# EasyEDA schematic SCH_AcondicionadorSeñal.json
TITLE: Acondicionador de Señal; REV: 1.0; Date: 2025-07-11; Sheet: 1/1; Drawn By: Fernando Alexis Vale; Company: LABTEL Productions
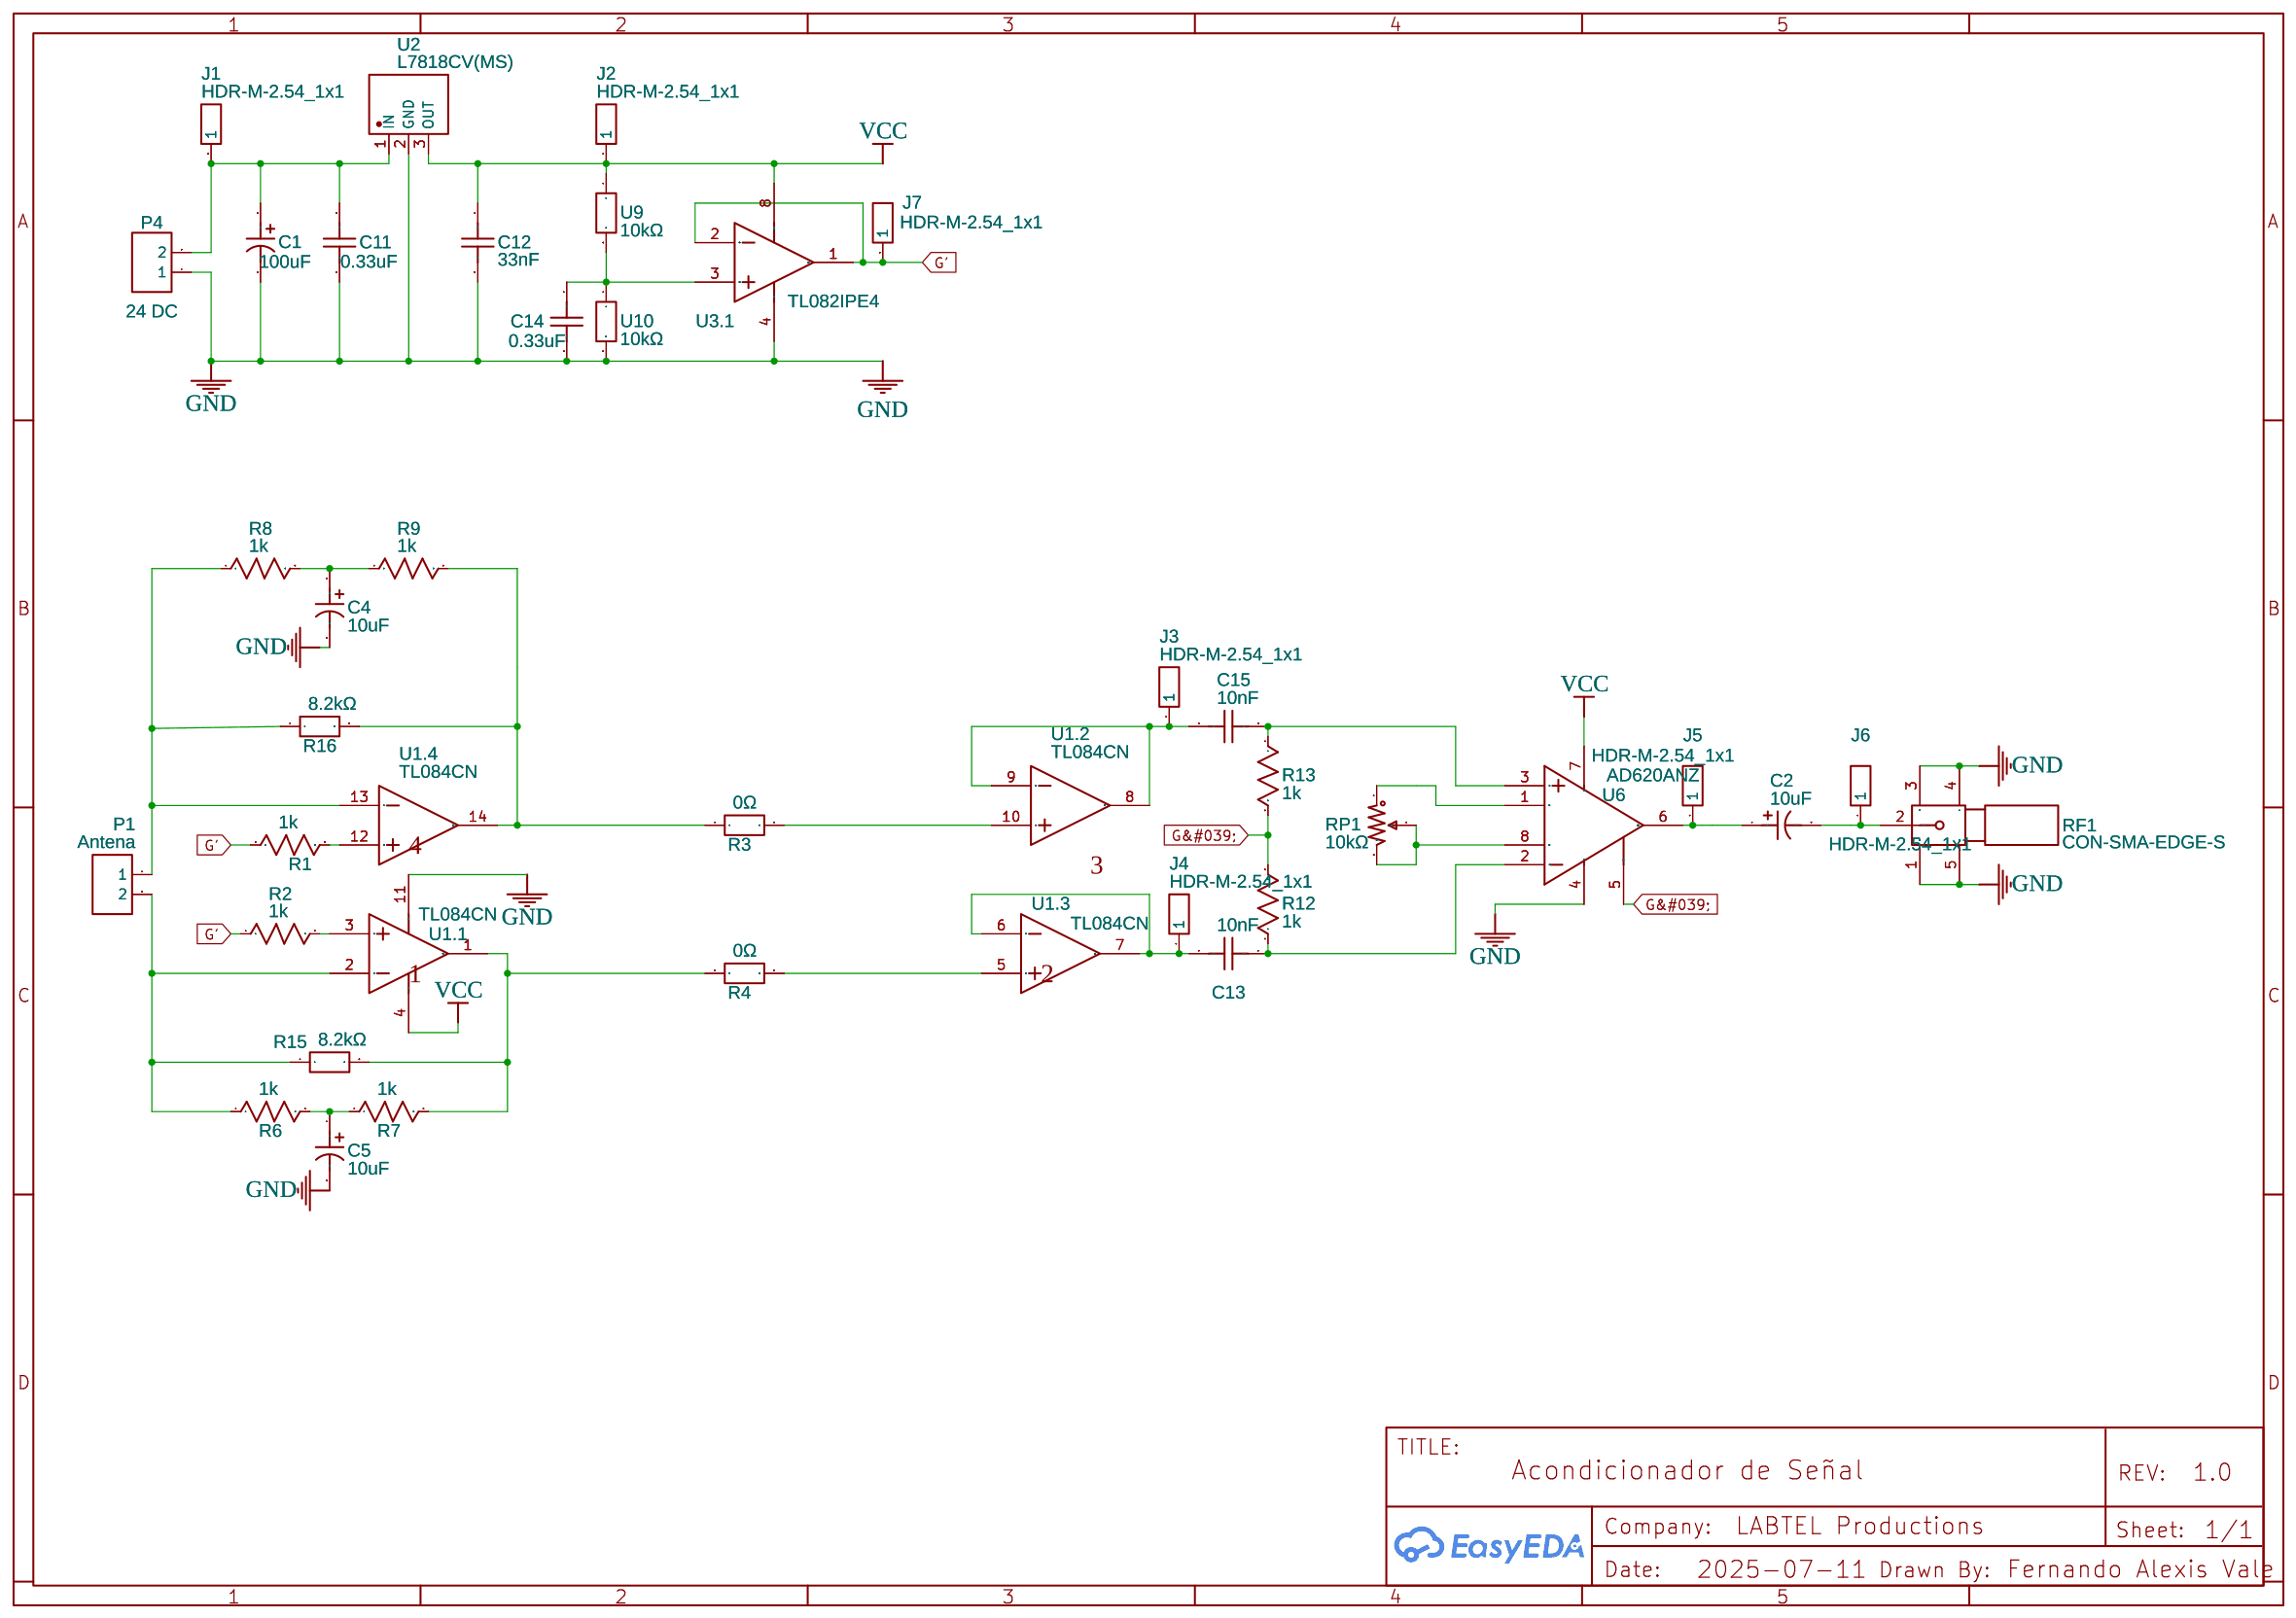
[diagram p0: schematic sheet]

## Parts
C1  100uF  [CAP-TH_BD6.3-P2.50-D0.5-FD]
C2  10uF  [CAP-TH_BD6.3-P2.50-D0.5-FD]
C4  10uF  [CAP-TH_BD6.3-P2.50-D0.5-FD]
C5  10uF  [CAP-TH_BD6.3-P2.50-D0.5-FD]
C11  0.33uF  [CAP-TH_L4.8-W3.2-P5.08-D0.5]
C12  33nF  [CAP-TH_L4.8-W3.2-P5.08-D0.5]
C13  10nF  [CAP-TH_L4.8-W3.2-P5.08-D1.2]
C14  0.33uF  [CAP-TH_L4.8-W3.2-P5.08-D0.5]
C15  10nF  [CAP-TH_L4.8-W3.2-P5.08-D1.2]
J1  HDR-M-2.54_1x1  [HDR-M-2.54_1X1]
J2  HDR-M-2.54_1x1  [HDR-M-2.54_1X1]
J3  HDR-M-2.54_1x1  [HDR-M-2.54_1X1]
J4  HDR-M-2.54_1x1  [HDR-M-2.54_1X1]
J5  HDR-M-2.54_1x1  [HDR-M-2.54_1X1]
J6  HDR-M-2.54_1x1  [HDR-M-2.54_1X1]
J7  HDR-M-2.54_1x1  [HDR-M-2.54_1X1]
P1  Antena  [CONN-TH_2P-P5.00]
P4  24 DC  [CONN-TH_2P-P5.00]
R1  1k  [R_AXIAL-0.4]
R2  1k  [R_AXIAL-0.4]
R3  0Ω  [RES-TH_BD2.7-L6.2-P10.20-D0.4]
R4  0Ω  [RES-TH_BD2.7-L6.2-P10.20-D0.4]
R6  1k  [R_AXIAL-0.4]
R7  1k  [R_AXIAL-0.4]
R8  1k  [R_AXIAL-0.4]
R9  1k  [R_AXIAL-0.4]
R12  1k  [R_AXIAL-0.4]
R13  1k  [R_AXIAL-0.4]
R15  8.2kΩ  [RES-TH_BD2.7-L6.2-P10.20-D0.4]
R16  8.2kΩ  [RES-TH_BD2.7-L6.2-P10.20-D0.4]
RF1  CON-SMA-EDGE-S  [SMA-SMD_CON-SMA-EDGE-S]
RP1  10kΩ  [TRIMPOT 9.53MM X 4.83MM]
U1  TL084CN  [DIP-14_L20.0-W7.6-P2.54-LS7.6-BL]  (sections 1,2,3,4)
U2  L7818CV(MS)  [TO-220-3_L9.9-W4.5-P2.54-L-1]
U3  TL082IPE4  [PDIP-8_L9.6-W6.4-P2.54-LS7.9-BL-1]  (section 1)
U6  AD620ANZ  [DIP-8_L9.3-W6.4-P2.54-LS7.6-BL]
U9  10kΩ  [RES-TH_BD2.3-L6.3-P10.30-D0.6]
U10  10kΩ  [RES-TH_BD2.3-L6.3-P10.30-D0.6]

## Library data of the parts
C1 C4 C5 = UPJ2A100MED: Supplier: LCSC; Supplier Part: C1582244; Manufacturer: Nichicon(尼吉康); JLCPCB Part Class: Extended Part; Contributor: lcsc
C2 = NPXC0421E100MJTM: Supplier: LCSC; Supplier Part: C2976241; Manufacturer: Ymin(永铭); Contributor: lcsc; JLCPCB Part Class: Extended Part
C11 C12 C14 = CC4-0805-CG -50V-33pF-J: Contributor: LCSC; Supplier: LCSC; Supplier Part: C123153; Manufacturer: TORCH(火炬); Manufacturer Part: CC4-0805-CG-50V-33pF-J; JLCPCB Part Class: Extended Part
C13 C15 = CC1H103ZC1ED3F4D1100: Supplier: LCSC; Supplier Part: C2761727; Manufacturer: Dersonic(德尔创); JLCPCB Part Class: Extended Part; Contributor: lcsc
J1-J7 = HDR-M-2.54_1x1: Supplier Part: C81276; Supplier: LCSC; Contributor: LCEDA_Lib
P1 P4 = CONN-TH_2P-P5.00: Supplier: LCSC; Contributor: LCEDA_Lib
R1 R2 R6-R9 R12 R13 = R_AXIAL-0.4_US: Contributor: LCEDA_Lib
R3 R4 R15 R16 = CR1/4W-8K2±5%-OT52: Contributor: lcsc; Supplier: LCSC; Supplier Part: C2896910; Manufacturer: VO(翔胜); JLCPCB Part Class: Extended Part
RF1 = CON-SMA-EDGE-S: Supplier: LCSC; Supplier Part: C5356059; Manufacturer: RF Solutions; JLCPCB Part Class: Extended Part; Contributor: lcsc
RP1 = 3296W-1-103RLF: Manufacturer: Bourns Inc.; Supplier: Digi-Key; Supplier Part: 118-3296W-1-103RLFCT-ND; link: https://www.digikey.ca/en/products/detail/bourns-inc/3296W-1-103RLF/2535867; Contributor: deserresalex; Tolerance: 10%; Power: ½W
U1 = TL084CN: subpart_no: 1; image: http://image.lceda.cn/szlcsc/C5163.jpg; Supplier Part: C5163; Supplier: LCSC; Manufacturer Part: STMicroelectronics
U2 = L7818CV(MS): Supplier: LCSC; Supplier Part: C20538901; Manufacturer: MSKSEMI(美森科); JLCPCB Part Class: Extended Part; Contributor: lcsc
U3 = TL082IPE4: subpart_no: 1; Supplier: LCSC; Supplier Part: C4370501; Manufacturer: TI(德州仪器); JLCPCB Part Class: Extended Part
U6 = AD620ANZ: Supplier: LCSC; Manufacturer: ADI(亚德诺); Supplier Part: C9680; JLCPCB Part Class: Extended Part
U9 U10 = LR1F10K: Supplier: LCSC; Supplier Part: C1367502; Manufacturer: TE Connectivity(泰科电子); JLCPCB Part Class: Extended Part; Contributor: lcsc

## Nets
GND: C1.2 C4.2 C5.2 C11.2 C12.2 C14.2 P4.1 RF1.1 RF1.3 RF1.4 RF1.5 U1.11(V-) U2.2(GND) U3.4(VCC-) U6.4(-VS) U10.2
VCC: C12.1 J2.1 U1.4(V+) U2.3(OUT) U3.8(VCC+) U6.7(+VS) U9.1
G&#039;: R12.2 R13.2 U6.5(REF)
G': J7.1 R1.1 R2.1 U3.1(1OUT) U3.2(1IN-)
Net-(C1-1): C1.1 C11.1 J1.1 P4.2 U2.1(IN)
Net-(C2-1): C2.1 J5.1 U6.6(OUTPUT)
Net-(C2-2): C2.2 J6.1 RF1.2
Net-(C4-1): C4.1 R8.2 R9.1
Net-(C5-1): C5.1 R6.2 R7.1
Net-(C13-1): C13.1 J4.1 U1.6(IN-) U1.7(OUT)
Net-(C13-2): C13.2 R12.1 U6.2(-IN)
Net-(C14-1): C14.1 U3.3(1IN+) U9.2 U10.1
Net-(C15-1): C15.1 J3.1 U1.8(OUT) U1.9(IN-)
Net-(C15-2): C15.2 R13.1 U6.3(+IN)
Net-(P1-1): P1.1 R8.1 R16.1 U1.13(IN-)
Net-(P1-2): P1.2 R6.1 R15.1 U1.2(IN-)
Net-(R1-2): R1.2 U1.12(IN+)
Net-(R2-2): R2.2 U1.3(IN+)
Net-(R3-1): R3.1 R9.2 R16.2 U1.14(OUT)
Net-(R3-2): R3.2 U1.10(IN+)
Net-(R4-1): R4.1 R7.2 R15.2 U1.1(OUT)
Net-(R4-2): R4.2 U1.5(IN+)
Net-(RP1-1): RP1.1 U6.1(RG)
Net-(RP1-2): RP1.2 RP1.3 U6.8(RG)
